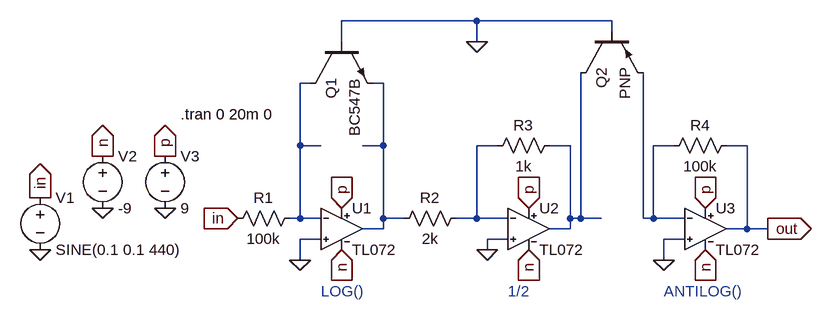
[diagram p0: schematic square-root-npn.asc]
square-root-npn.asc, the LTspice schematic file:
Version 4
SHEET 1 1380 680
WIRE 448 16 240 16
WIRE 656 16 448 16
WIRE 656 32 656 16
WIRE 240 48 240 16
WIRE 448 48 448 16
WIRE 192 112 176 112
WIRE 304 112 288 112
WIRE 176 208 176 112
WIRE 208 208 176 208
WIRE 304 208 304 112
WIRE 304 208 272 208
WIRE 480 208 448 208
WIRE 592 208 560 208
WIRE 752 208 720 208
WIRE 864 208 832 208
WIRE 176 320 176 208
WIRE 176 320 160 320
WIRE 208 320 176 320
WIRE 304 320 304 208
WIRE 336 320 304 320
WIRE 448 320 448 208
WIRE 448 320 416 320
WIRE 496 320 448 320
WIRE 592 320 592 208
WIRE 608 320 608 96
WIRE 608 320 592 320
WIRE 640 320 608 320
WIRE 704 320 704 96
WIRE 720 320 720 208
WIRE 720 320 704 320
WIRE 768 320 720 320
WIRE 304 336 304 320
WIRE 304 336 272 336
WIRE 592 336 592 320
WIRE 592 336 560 336
WIRE 864 336 864 208
WIRE 864 336 832 336
WIRE 896 336 864 336
WIRE 208 352 176 352
WIRE 496 352 464 352
WIRE 768 352 736 352
WIRE 464 368 464 352
WIRE 176 384 176 352
WIRE 736 384 736 352
FLAG 176 384 0
FLAG 80 320 in
IOPIN 80 320 In
FLAG 240 304 p
IOPIN 240 304 In
FLAG 240 368 n
IOPIN 240 368 In
FLAG -224 368 0
FLAG -128 304 0
FLAG -32 304 0
FLAG -32 224 p
IOPIN -32 224 Out
FLAG -128 224 n
IOPIN -128 224 Out
FLAG -224 288 in
IOPIN -224 288 Out
FLAG 464 368 0
FLAG 528 304 p
IOPIN 528 304 In
FLAG 528 368 n
IOPIN 528 368 In
FLAG 736 384 0
FLAG 800 304 p
IOPIN 800 304 In
FLAG 800 368 n
IOPIN 800 368 In
FLAG 896 336 out
IOPIN 896 336 Out
FLAG 448 48 0
SYMBOL TL072 240 272 R0
SYMATTR InstName U1
SYMBOL Voltage -224 272 R0
SYMATTR InstName V1
SYMATTR Value SINE(0.1 0.1 440)
SYMBOL Voltage -128 208 R0
SYMATTR InstName V2
SYMATTR Value -9
SYMBOL Voltage -32 208 R0
SYMATTR InstName V3
SYMATTR Value 9
SYMBOL Res 176 304 R90
WINDOW 0 0 56 VBottom 2
WINDOW 3 32 56 VTop 2
SYMATTR InstName R1
SYMATTR Value 100k
SYMBOL TL072 528 272 R0
SYMATTR InstName U2
SYMBOL TL072 800 272 R0
SYMATTR InstName U3
SYMBOL Res 848 192 R90
WINDOW 0 0 56 VBottom 2
WINDOW 3 32 56 VTop 2
SYMATTR InstName R4
SYMATTR Value 100k
SYMBOL npn 192 48 M90
SYMATTR InstName Q1
SYMATTR Value BC547B
SYMBOL Res 576 192 R90
WINDOW 0 0 56 VBottom 2
WINDOW 3 32 56 VTop 2
SYMATTR InstName R3
SYMATTR Value 1k
SYMBOL Res 432 304 R90
WINDOW 0 0 56 VBottom 2
WINDOW 3 32 56 VTop 2
SYMATTR InstName R2
SYMATTR Value 2k
SYMBOL pnp 608 32 M90
SYMATTR InstName Q2
TEXT -8 160 Left 2 !.tran 0 20m 0
TEXT 208 432 Left 2 ;LOG()
TEXT 496 432 Left 2 ;1/2
TEXT 736 432 Left 2 ;ANTILOG()

The netlist it stands for:
* square-root-npn.asc
XU1 0 N001 p n N002 TL072  ; pins In+ In- V+ V- OUT
V1 in 0 SINE(0.1 0.1 440)
V2 n 0 -9
V3 p 0 9
R1 N001 in 100k
XU2 0 N003 p n N004 TL072  ; pins In+ In- V+ V- OUT
XU3 0 N005 p n out TL072  ; pins In+ In- V+ V- OUT
R4 out N005 100k
Q1 N001 0 N002 0 BC547B
R3 N004 N003 1k
R2 N003 N002 2k
Q2 N004 0 N005 0 PNP
.model NPN NPN
.model PNP PNP
.lib standard.bjt
.tran 0 20m 0
* LOG()
* 1/2
* ANTILOG()
.lib TL072.sub
.backanno
.end